# Altium schematic sheet Mach trai tim - Hieu.SchDoc: Hoc vien
size A4; Date: 7/12/2016; CheckedBy: PCB Electric; CompanyName: Mach TRAI TIM; DrawnBy: Dinh Hieu; Engineer: Dinh Hieu; Organization: PCB Electric; DocumentNumber: 1; Revision: 1.0; SheetNumber: 1; SheetTotal: 1; CurrentTime: 19:30; CurrentDate: 7/12/2016; Time: 19:30; DocumentFullPathAndName: Mach TRAI TIM; DocumentName: Mach TRAI TIM; ModifiedDate: 7/12/2016; ProjectName: Mach TRAI TIM; Application_BuildNumber: Mach TRAI TIM
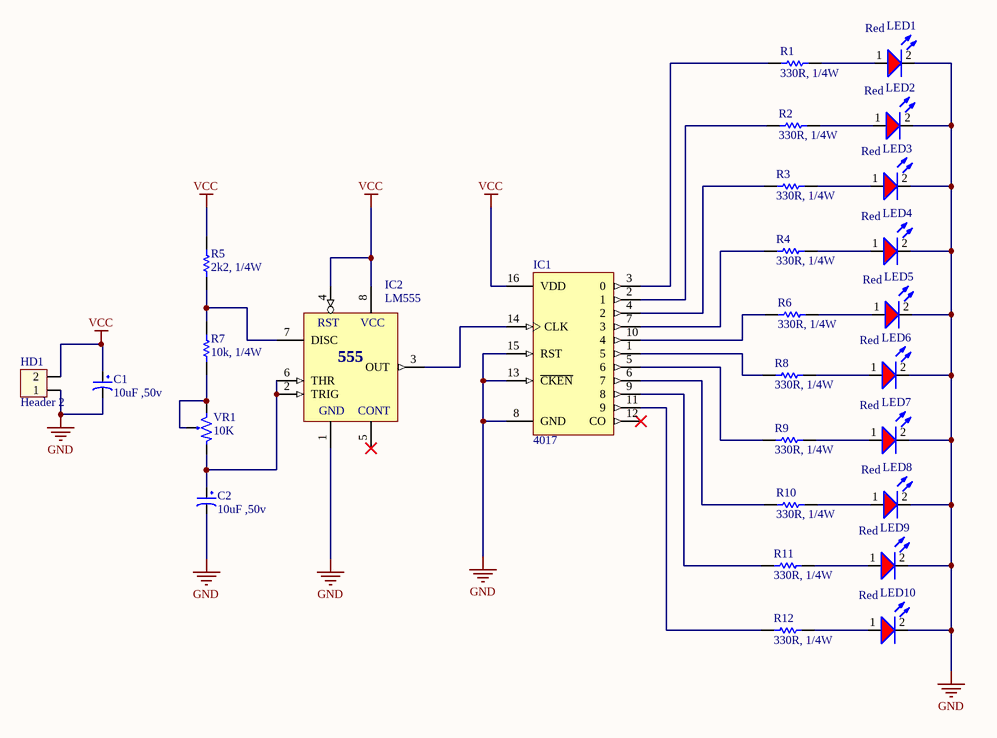
[diagram p0: Mach trai tim - Hieu.SchDoc]

## Parts
C1  10uF ,50v  [CAP_1UF_50V]
C2  10uF ,50v  [CAP_1UF_50V]
HD1  Header 2  [CON2]
IC1  4017  [74HC4017]
IC2  LM555  [LM555]
LED1  value Red  [LED5R]  (hidden comment: LED_R_3)
LED2  value Red  [LED5R]  (hidden comment: LED_R_3)
LED3  value Red  [LED5R]  (hidden comment: LED_R_3)
LED4  value Red  [LED5R]  (hidden comment: LED_R_3)
LED5  value Red  [LED5R]  (hidden comment: LED_R_3)
LED6  value Red  [LED5R]  (hidden comment: LED_R_3)
LED7  value Red  [LED5R]  (hidden comment: LED_R_3)
LED8  value Red  [LED5R]  (hidden comment: LED_R_3)
LED9  value Red  [LED5R]  (hidden comment: LED_R_3)
LED10  value Red  [LED5R]  (hidden comment: LED_R_3)
R1  value 330R, 1/4W  [RES 1/4W CFR25]  (hidden comment: CF1/4W1KJ25)
R2  value 330R, 1/4W  [RES 1/4W CFR25]  (hidden comment: CF1/4W1KJ25)
R3  value 330R, 1/4W  [RES 1/4W CFR25]  (hidden comment: CF1/4W1KJ25)
R4  value 330R, 1/4W  [RES 1/4W CFR25]  (hidden comment: CF1/4W1KJ25)
R5  value 2k2, 1/4W  [RES 1/4W CFR25]  (hidden comment: CF1/4W1KJ25)
R6  value 330R, 1/4W  [RES 1/4W CFR25]  (hidden comment: CF1/4W1KJ25)
R7  value 10k, 1/4W  [RES 1/4W CFR25]  (hidden comment: CF1/4W1KJ25)
R8  value 330R, 1/4W  [RES 1/4W CFR25]  (hidden comment: CF1/4W1KJ25)
R9  value 330R, 1/4W  [RES 1/4W CFR25]  (hidden comment: CF1/4W1KJ25)
R10  value 330R, 1/4W  [RES 1/4W CFR25]  (hidden comment: CF1/4W1KJ25)
R11  value 330R, 1/4W  [RES 1/4W CFR25]  (hidden comment: CF1/4W1KJ25)
R12  value 330R, 1/4W  [RES 1/4W CFR25]  (hidden comment: CF1/4W1KJ25)
VR1  10K  [VR1]

## Nets
GND: C1.2 C2.2 HD1.1 IC1.8(GND) IC1.13(~{CKEN}) IC1.15(RST) IC2.1(GND) LED1.2(K) LED2.2(K) LED3.2(K) LED4.2(K) LED5.2(K) LED6.2(K) LED7.2(K) LED8.2(K) LED9.2(K) LED10.2(K)
VCC: C1.1 HD1.2 IC1.16(VDD) IC2.4(RST) IC2.8(VCC) R5.2
NetC2_1: C2.1 IC2.2(TRIG) IC2.6(THR) VR1.1
NetIC1_1: IC1.1(5) R8.2
NetIC1_2: IC1.2(1) R2.2
NetIC1_3: IC1.3(0) R1.2
NetIC1_4: IC1.4(2) R3.2
NetIC1_5: IC1.5(6) R9.2
NetIC1_6: IC1.6(7) R10.2
NetIC1_7: IC1.7(3) R4.2
NetIC1_9: IC1.9(8) R11.2
NetIC1_10: IC1.10(4) R6.2
NetIC1_11: IC1.11(9) R12.2
NetIC1_14: IC1.14(CLK) IC2.3(OUT)
NetIC2_7: IC2.7(DISC) R5.1 R7.2
NetLED1_1: LED1.1(A) R1.1
NetLED2_1: LED2.1(A) R2.1
NetLED3_1: LED3.1(A) R3.1
NetLED4_1: LED4.1(A) R4.1
NetLED5_1: LED5.1(A) R6.1
NetLED6_1: LED6.1(A) R8.1
NetLED7_1: LED7.1(A) R9.1
NetLED8_1: LED8.1(A) R10.1
NetLED9_1: LED9.1(A) R11.1
NetLED10_1: LED10.1(A) R12.1
NetR7_1: R7.1 VR1.2 VR1.3

Not connected (* = marked no-connect by the designer): IC1 12(CO)*; IC2 5(CONT)*

## Notes on the sheet
- (in symbol LM555) 555

## Library data of the parts
C1 C2 = CP1: Cap P  0,1uF < 22uF , 16 - 50V; Value: 10uF/50V; Description 1: 10 => 220uF/6,3V/10V - 10uF => 100uF/16V; Description 2: 0,1uF => 33uF/50V - 10uF => 22uF/63V; Description 3: 0,47uF => 10uF/100V
HD1 = Hed2: Header 2 (Green); Value: Header 2
IC1 = 4017: Decade Counter/Divider with 10 Decoded Outputs; Designed by: VanDungEvn; Value: CD4017
IC2 = LM555: Timer; Value: LM555
LED1-LED10 = LED_RED_3MM: LED Red 3mm; ComponentLink1Description: Datasheet; ComponentLink1URL: D:\Dropbox\Datasheets\Opto and Illumination\LEDs\SMD LED.pdf; Unit Price: 0.0476
R1-R12 = CF1/4W1KJ25: RES CF AXIAL-0.3 5% 1/4W 1K; Unit Price: 0.001; ComponentLink1Description: Datasheet; ComponentLink1URL: D:\Dropbox\Datasheets\Passive Components\Resistors\Carbon Film Resistor.pdf
VR1 = VR1: Var Resistor; Value: VR 10K